# Altium schematic sheet ps2_connector.SchDoc
size A4; Engineer: Amir Hossein Jobeiri; Organization: Simaran; SheetNumber: 19; SheetTotal: 23
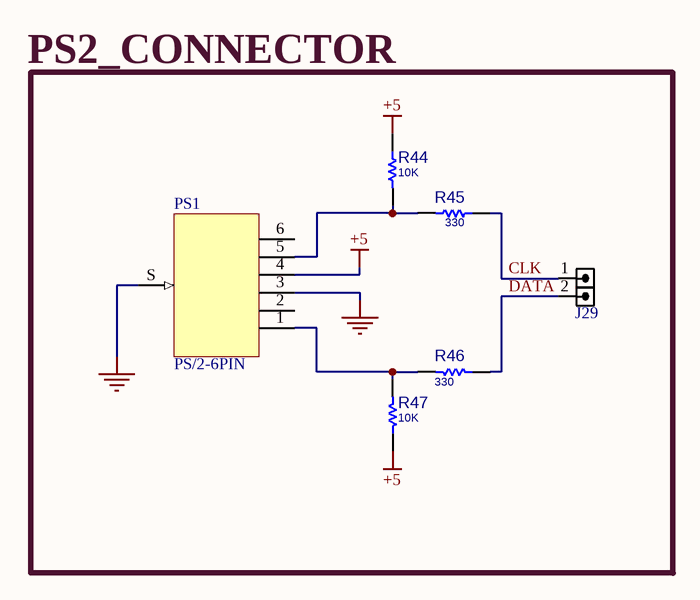
[diagram p0: ps2_connector.SchDoc]

## Parts
J29  HDRMINI_2  [HDRMINI_M_1X2]  (value not drawn)
PS1  PS/2-6PIN
R44  10K  [R025W_AX04]
R45  330  [R025W_AX04]
R46  330  [R025W_AX04]
R47  10K  [R025W_AX04]

## Blocks framed on the sheet
PS2_CONNECTOR: J29 PS1 R44-R47

## Nets
+5: PS1.4 R44.1 R47.1
GND: PS1.3 PS1.S
CLK: J29.1 R45.1
DATA: J29.2 R46.1
NetPS1_1: PS1.1 R46.2 R47.2
NetPS1_5: PS1.5 R44.2 R45.2

Not connected (* = marked no-connect by the designer): PS1 2 6

## Library data of the parts
J29 = HDRMINI_M_1X2_1: CONN, HEADER, Male, pitch: 1.27mm, 2POS; VALUE: HDRMINI_2
PS1 = PS/2_CONNECTOR: CREATED BY J; VALUE: PS/2-6PIN; MANF: *; MANF_P#: *; PARAM: *; PARAM1: *
R44-R47 = RES_THD: RESISTOR, THD; MANF_P#: RK73H1ETTP4701F; MANF: KOA SPEER; PARAM: 0.063W; DESC: DESCRIPTION; DIST#: MOUSER; PARAM2: 1%; ASSEMBLY: ASSEMBLY; PRICE: 100= 0.5$
  R44 R47: VALUE: 10K
  R45 R46: VALUE: 330